# EAGLE schematic schema (EAGLE 9.5.0)
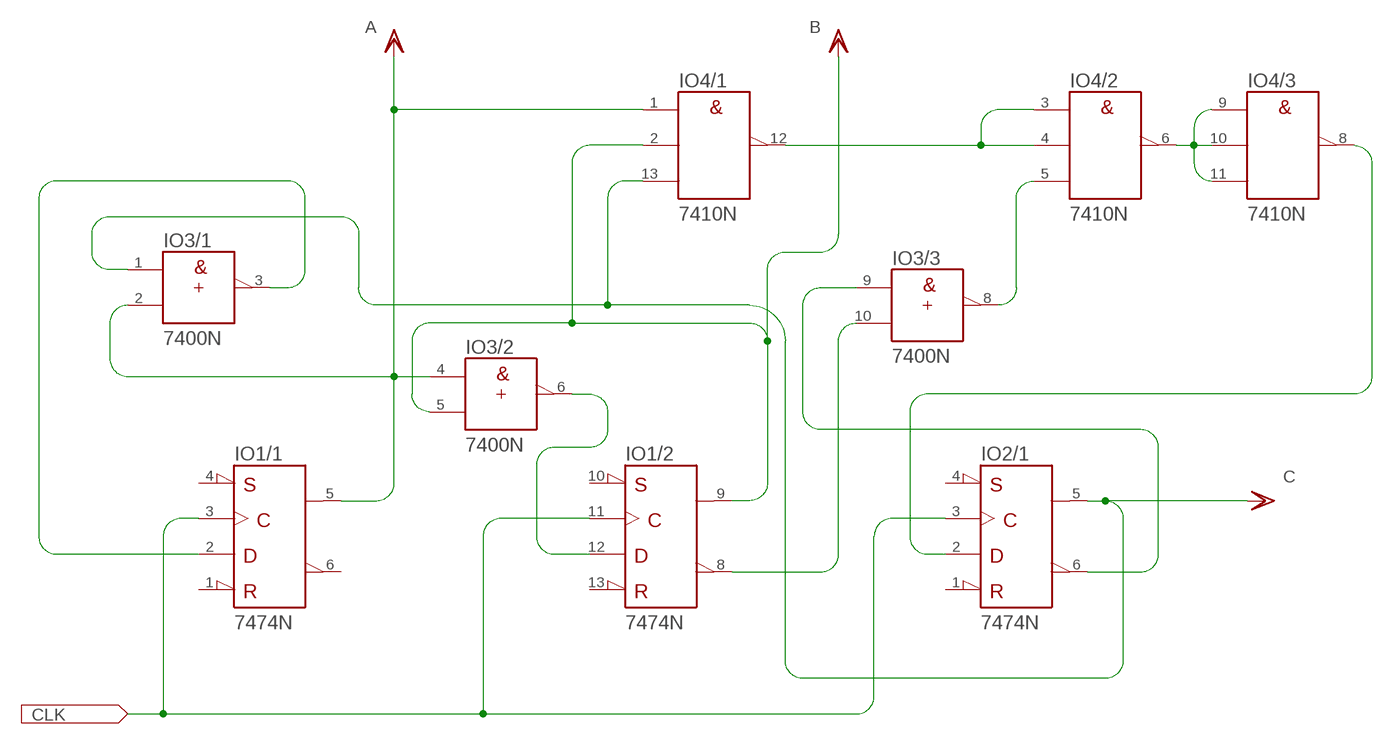
[diagram p0: schematic, sheet 1]

## Parts
IO1  7474N  [DIL14]
IO2  7474N  [DIL14]
IO3  7400N  [DIL14]
IO4  7410N  [DIL14]

## Nets
A: IO1.5(/1:Q) IO3.2(/1:B) IO3.4(/2:A) IO4.1(/1:A)
B$1: IO1.3(/1:CLK) IO1.11(/2:CLK) IO2.3(/1:CLK)
N$1: IO1.2(/1:D) IO3.3(/1:Y)
N$2: IO2.5(/1:Q) IO3.1(/1:A) IO4.13(/1:C) ; supply symbol labelled C
N$3: IO1.12(/2:D) IO3.6(/2:Y)
N$6: IO1.8(/2:!Q) IO3.10(/3:B)
N$7: IO2.6(/1:!Q) IO3.9(/3:A)
N$8: IO4.3(/2:A) IO4.4(/2:B) IO4.12(/1:Y)
N$9: IO3.8(/3:Y) IO4.5(/2:C)
N$10: IO4.6(/2:Y) IO4.9(/3:A) IO4.10(/3:B) IO4.11(/3:C)
N$11: IO2.2(/1:D) IO4.8(/3:Y)
VDD: IO1.9(/2:Q) IO3.5(/2:B) IO4.2(/1:B) ; supply symbol labelled B
Unconnected: IO1.1(/1:!CLR) IO1.4(/1:!PRE) IO1.6(/1:!Q) IO1.10(/2:!PRE) IO1.13(/2:!CLR) IO2.1(/1:!CLR) IO2.4(/1:!PRE) IO2.8(/2:!Q) IO2.9(/2:Q) IO2.10(/2:!PRE) IO2.11(/2:CLK) IO2.12(/2:D) IO2.13(/2:!CLR) IO3.11(/4:Y) IO3.12(/4:A) IO3.13(/4:B)

## Power pins joined to a net without a drawn wire
+UB: IO1.14(/+UB:+UB) IO2.14(/+UB:+UB) IO3.14(/+UB:+UB) IO4.14(/+UB:+UB)
-UB: IO1.7(/-UB:-UB) IO2.7(/-UB:-UB) IO3.7(/-UB:-UB) IO4.7(/-UB:-UB)

## Library data of the parts
IO1 IO2 = 74ttl-din:74*74: Dual D type positive edge triggered FLIP FLOP, preset and clear
IO3 = 74ttl-din:74*00: Quad 2-input NAND gate
IO4 = 74ttl-din:74*10: Triple 3-input NAND gate